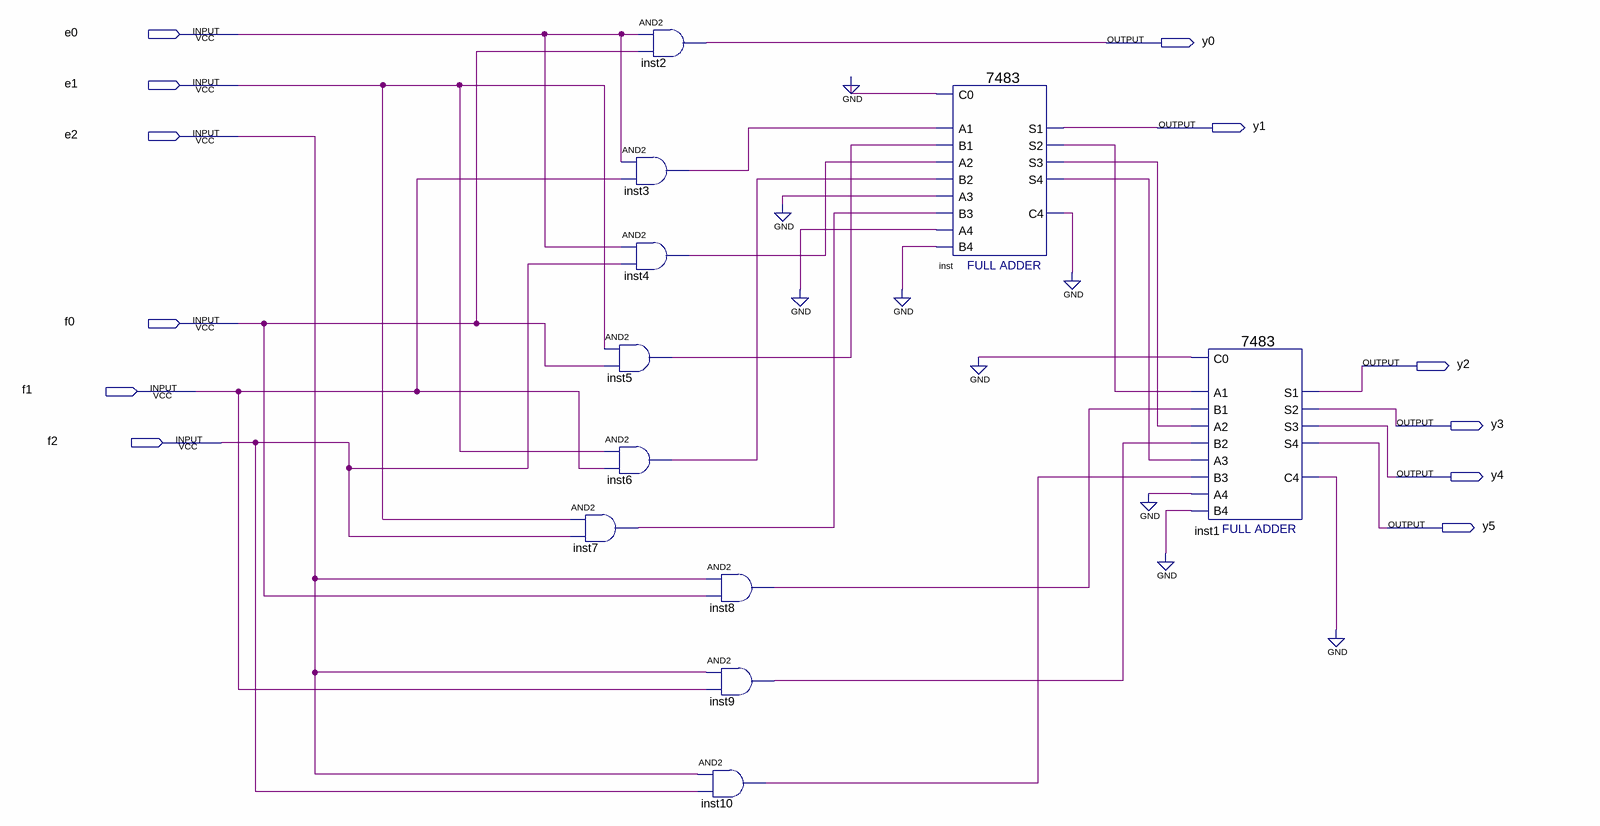
[diagram p0: schematic sheet]
// Quartus schematic multiplier.bdf as structural Verilog: 11 symbols, 12 pins
module multiplier (
  input  e0,
  input  e1,
  input  e2,
  input  f0,
  input  f1,
  input  f2,
  output y0,
  output y1,
  output y2,
  output y3,
  output y4,
  output y5
);

  wire inst1_c4, inst3_out, inst4_out, inst5_out, inst6_out, inst7_out, inst8_out, inst9_out, inst10_out,
       inst_c4, inst_s2, inst_s3, inst_s4;

  and inst7 (inst7_out, e1, f2);
  and inst2 (y0, e0, f0);
  and inst3 (inst3_out, e0, f1);
  and inst4 (inst4_out, e0, f2);
  and inst5 (inst5_out, e1, f0);
  and inst6 (inst6_out, e1, f1);
  and inst8 (inst8_out, e2, f0);
  and inst9 (inst9_out, e2, f1);
  and inst10 (inst10_out, e2, f2);
  \7483  inst (
    .B4(1'b0), .C0(1'b0), .A1(inst3_out), .A2(inst4_out), .B1(inst5_out), .B2(inst6_out), .A3(1'b0),
    .B3(inst7_out), .A4(1'b0), .S3(inst_s3), .S4(inst_s4), .S2(inst_s2), .C4(inst_c4), .S1(y1));
  \7483  inst1 (
    .B4(1'b0), .C0(1'b0), .A1(inst_s2), .A2(inst_s3), .B1(inst8_out), .B2(inst9_out), .A3(inst_s4),
    .B3(inst10_out), .A4(1'b0), .S3(y4), .S4(y5), .S2(y3), .C4(inst1_c4), .S1(y2));
  // also tied to GND on the sheet: {inst_c4, inst1_c4}
endmodule
